# EAGLE design Mentor (EAGLE 8.2.1)
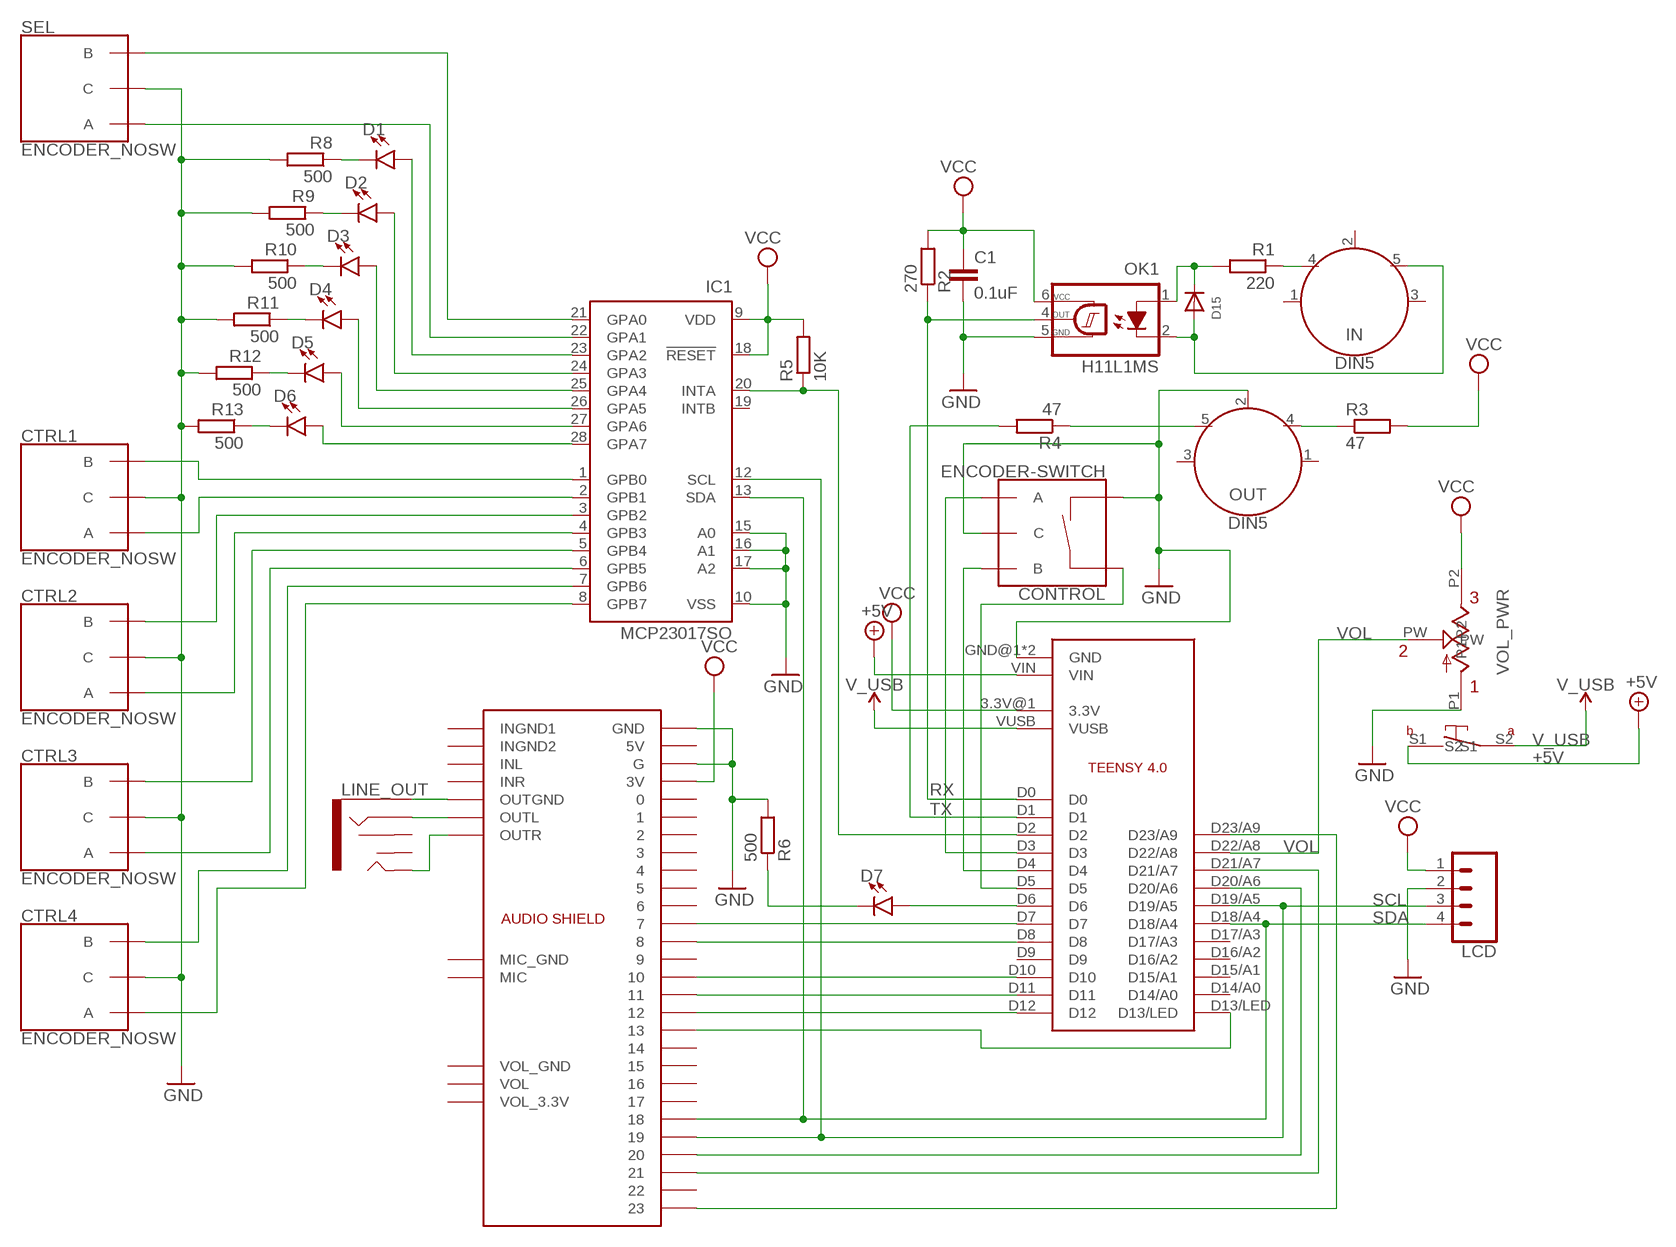
[diagram p0: schematic, sheet 1]

## Parts
C1  0.1uF  C-EUC0603K  [C0603K]
CONTROL  ENCODER-SWITCH  [ROTARY_ENC_PLAIN]
CTRL1  ENCODER_NOSW  [ENCODER_NOSW]
CTRL2  ENCODER_NOSW  [ENCODER_NOSW]
CTRL3  ENCODER_NOSW  [ENCODER_NOSW]
CTRL4  ENCODER_NOSW  [ENCODER_NOSW]
D1  LED3MM  [LED_3MM]
D2  LED3MM  [LED_3MM]
D3  LED3MM  [LED_3MM]
D4  LED3MM  [LED_3MM]
D5  LED3MM  [LED_3MM]
D6  LED3MM  [LED_3MM]
D7  LED3MM  [LED_3MM]
D15  DIODESOD-123  [SOD-123]
IC1  MCP23017SO  [SO28W]
IN  DIN5  [DIN5-RA-PTH]
LCD  CONN_04LONGPADS  [1X04_LONGPADS]
LINE_OUT  AUDIO_JACK_3.5MM_PTH  [AUDIO-JACK]
OK1  H11L1MS  [DIL6-SMD]
OUT  DIN5  [DIN5-RA-PTH]
R1  220  R-EU_R0603  [R0603]
R2  270  R-EU_R0603  [R0603]
R3  47  R-EU_R0603  [R0603]
R4  47  R-EU_R0603  [R0603]
R5  10K  R-EU_R0603  [R0603]
R6  500  R-EU_R0603  [R0603]
R8  500  R-EU_R0603  [R0603]
R9  500  R-EU_R0603  [R0603]
R10  500  R-EU_R0603  [R0603]
R11  500  R-EU_R0603  [R0603]
R12  500  R-EU_R0603  [R0603]
R13  500  R-EU_R0603  [R0603]
SEL  ENCODER_NOSW  [ENCODER_NOSW]
U$2  TEENSY4.0_SIMPLE  [TEENSY4.0_SIMPLE]
U$3  AUDIO SHIELD  AUDIOSHIELD  [AUDIOSHIELD]
VOL_PWR  10K  RK097-SINGLE-W/SWITCH-ROTARY  [RK097-SINGLE-W/SWITCH]

## Nets
+5V: U$2.VIN VOL_PWR.S1
GND: C1.2 CONTROL.C CONTROL.SW- CTRL1.C CTRL2.C CTRL3.C CTRL4.C IC1.10(VSS) IC1.15(A0) IC1.16(A1) IC1.17(A2) LCD.2 OK1.5(GND) OUT.2 R6.2 R8.2 R9.2 R10.2 R11.2 R12.2 R13.2 SEL.C U$2.GND@1(GND) U$2.GND@2(GND) U$3.G U$3.GND VOL_PWR.P1
MISO: U$2.D12 U$3.12
MOSI: U$2.D11 U$3.11
N$1: IC1.21(GPA0) SEL.B
N$2: IC1.22(GPA1) SEL.A
N$3: CTRL1.B IC1.1(GPB0)
N$4: CTRL1.A IC1.2(GPB1)
N$5: CTRL2.B IC1.3(GPB2)
N$6: CTRL2.A IC1.4(GPB3)
N$7: CTRL3.B IC1.5(GPB4)
N$8: CTRL3.A IC1.6(GPB5)
N$9: CTRL4.B IC1.7(GPB6)
N$10: CTRL4.A IC1.8(GPB7)
N$11: OUT.5 R4.1
N$12: U$2.D20/A6 U$3.20
N$13: U$2.D21/A7 U$3.21
N$14: U$2.D23/A9 U$3.23
N$15: U$2.D10 U$3.10
N$16: U$2.D7 U$3.7
N$17: U$2.D8 U$3.8
N$18: IC1.20(INTA) R5.1 U$2.D2
N$19: D6.K(C) R13.1
N$20: D1.K(C) R8.1
N$21: D6.A IC1.28(GPA7)
N$22: D7.K(C) R6.1
N$23: D7.A U$2.D6
N$24: D2.K(C) R9.1
N$25: D3.K(C) R10.1
N$26: D3.A IC1.25(GPA4)
N$27: CONTROL.A U$2.D3
N$28: CONTROL.B U$2.D4
N$29: CONTROL.SW+ U$2.D5
N$30: D4.K(C) R11.1
N$32: D5.K(C) R12.1
N$36: D15.A IN.5 OK1.2(C)
N$37: D15.C OK1.1(A) R1.2
N$38: IN.4 R1.1
N$39: LINE_OUT.SLEEVE U$3.OUTGND
N$43: OUT.4 R3.1
N$44: LINE_OUT.RING U$3.OUTL
N$45: LINE_OUT.TIP U$3.OUTR
RX: OK1.4(OUT) R2.1 U$2.D0
SCK: U$2.D13/LED U$3.13
SCL: IC1.12(SCL) LCD.3 U$2.D19/A5 U$3.19
SDA: IC1.13(SDA) LCD.4 U$2.D18/A4 U$3.18
SEL1: D1.A IC1.23(GPA2)
SEL2: D2.A IC1.24(GPA3)
SEL4: D4.A IC1.26(GPA5)
SEL5: D5.A IC1.27(GPA6)
TX: R4.2 U$2.D1
V_USB: U$2.VUSB VOL_PWR.S2
VCC: C1.1 IC1.9(VDD) IC1.18(!RESET) LCD.1 OK1.6(VCC) R2.2 R3.2 R5.2 U$2.3.3V@1(3.3V) U$3.3V VOL_PWR.P2
VOL: U$2.D22/A8 VOL_PWR.PW
Unconnected: IC1.19(INTB) IN.1 IN.2 IN.3 LINE_OUT.RSH LINE_OUT.TSH OUT.1 OUT.3 U$2.D9 U$2.D14/A0 U$2.D15/A1 U$2.D16/A2 U$2.D17/A3 U$3.0 U$3.1 U$3.2 U$3.3 U$3.4 U$3.5 U$3.5V U$3.6 U$3.9 U$3.14 U$3.15 U$3.16 U$3.17 U$3.22 U$3.GND_MIC(MIC_GND) U$3.INGND1 U$3.INGND2 U$3.INL U$3.INR U$3.MIC U$3.VOL U$3.VOL_3.3V U$3.VOL_GND

## Notes on the sheet
- AUDIO SHIELD

## Library data of the parts
C1 = rcl:C-EU: CAPACITOR, European symbol
CONTROL = SparkFun-Switches:ENCODER-SWITCH: Rotary Encoder w/ Select Switch Encoders rotate similarly to potentiometers, but they’re different from potentiometers in that an encoder has full rotation without limits. They output gray code so that you can tell how much and in which direction the encoder has been turned. This encoder includes a push-down select switch built into the shaft. SparkFun Products Rotary Encoder <https://www.sparkfun.com/products/9117> (COM-09117); SF_SKU: COM-09117
CTRL1-CTRL4 SEL = SparkFun-Switches:ENCODER_NOSW
D1-D7 = SparkFun-LED:LED: LED (Generic) Standard schematic elements and footprints for 5mm, 3mm, 1206, and 0603 sized LEDs. Generic LEDs with no color specified.; PROD_ID: DIO-08794
D15 = adafruit:DIODE: Diode SMADIODE - SMA Surface Mount Package 20V 1A Schottky Diode Digikey: 641-1014-6-ND DO-1N4148 - Through Hole Small Current Diode SOD-123 20V 1 A (.5mV Vf) Schottky Diode - Digikey: MBRX120TPMSCT-ND SOD-323 10V 570mA (.38mV Vf, 3ns) Schottky Diode - Digikey: ZLLS410CT-ND SOD-523 30V 30mA Schottky Diode (RB751S-40TE61) - Digikey: RB751S-40TE61CT-ND SOT23-R/W - SOT23 Package (R = Solder Paste/Reflow Ovens, W = Hand-Soldering) BAT54Film 40V 300mA - Digikey: 497-7162-1-ND
IC1 = adafruit:MCP23017: http://ww1.microchip.com/downloads/en/DeviceDoc/21952a.pdf Source: http://ww1.microchip.com/downloads/en/DeviceDoc/21952a.pdf
IN OUT = SparkFun-Connectors:DIN5: DIN5 Connector - Female Right Angle (frequently used as a MIDI Jack connector) This type of connector and cable is frequently used for transmitting midi data (musical instrument digital interface). It is what you usually see on a keyboard or set of electronic drums. Learn more here <https://en.wikipedia.org/wiki/MIDI>. For more information on the pinout and electrical specifications of MIDI communications, please see the following resource: https://www.midi.org/specifications/item/midi-din-electrical-specification Here is the connector we sell at SparkFun: MIDI Connector - Female Right Angle <https://www.sparkfun.com/products/9536> (PRT-09536) Datasheet <hhttp://www.sparkfun.com/datasheets/Prototyping/Connectors/MIDI-RA.pdf> It is used on this SparkFun product: SparkFun MIDI Shield <https://www.sparkfun.com/products/12898> (DEV-12898); PROD_ID: CONN-09481
LCD = SparkFun-Connectors:CONN_04: Multi connection point. Often used as Generic Header-pin footprint for 0.1 inch spaced/style header connections On any of the 0.1 inch spaced packages, you can populate with these: Break Away Headers - Straight <https://www.sparkfun.com/products/116> (PRT-00116) Break Away Male Headers - Right Angle <https://www.sparkfun.com/products/553> (PRT-00553) Female Headers <https://www.sparkfun.com/products/115> (PRT-00115) Break Away Headers - Machine Pin <https://www.sparkfun.com/products/117> (PRT-00117) Break Away Female Headers - Swiss Machine Pin <https://www.sparkfun.com/products/743> (PRT-00743) For SCREWTERMINALS and SPRING TERMINALS visit here: Screw Terimnals on SparkFun.com <https://www.sparkfun.com/search/results?term=Screw+Terminals> (5mm/3.5mm/2.54mm spacing) This device is also useful as a general connection point to wire up your design to another part of your project. Our various solder wires solder well into these plated through hole pads. Hook-Up Wire - Assortment (Stranded, 22 AWG) <https://www.sparkfun.com/products/11375> (PRT-11375) Hook-Up Wire - Assortment (Solid Core, 22 AWG) <https://www.sparkfun.com/products/11367> (PRT-11367) View the entire wire category on our website here <https://www.sparkfun.com/categories/141> Special notes: Molex polarized connector foot print use with SKU : PRT-08231 with associated crimp pins and housings. 1MM SMD Version SKU: PRT-10208; PROD_ID: CONN-09696
LINE_OUT = SparkFun-Connectors:AUDIO_JACK_3.5MM: Audio Jack 3.5mm variants of PTH and SMT stereo audio jack with bypass switches. SparkFun Products: SparkFun SparkPunk Sound Kit <[https://www.sparkfun.com/products/11177]> - PTH MP3 Trigger <https://www.sparkfun.com/products/13720> -3.5mm SMD SparkFun PicoBoard <https://www.sparkfun.com/products/11888>- 2.5mm SMD; PROD_ID: CONN-08774; SF_ID: PRT-08032
OK1 = optocoupler:H11L*M: 6-Pin DIP Optocoupler Source: http://www.fairchildsemi.com/ds/H1/H11L2-M.pdf; OC_FARNELL: unknown; OC_NEWARK: unknown
R1-R6 R8-R13 = resistor:R-EU_: RESISTOR, European symbol
U$2 = Teensy4.0_SIMPLE:TEENSY4.0_SIMPLE
U$3 = Teensy_Audioshield_alt:AUDIOSHIELD: Teensy 3 Audioshield by PJRC.COM
VOL_PWR = alps_japan_potentiometers:RK097-SINGLE-W/SWITCH-ROTARY: Shematic Single Element w/ Switch

## Board
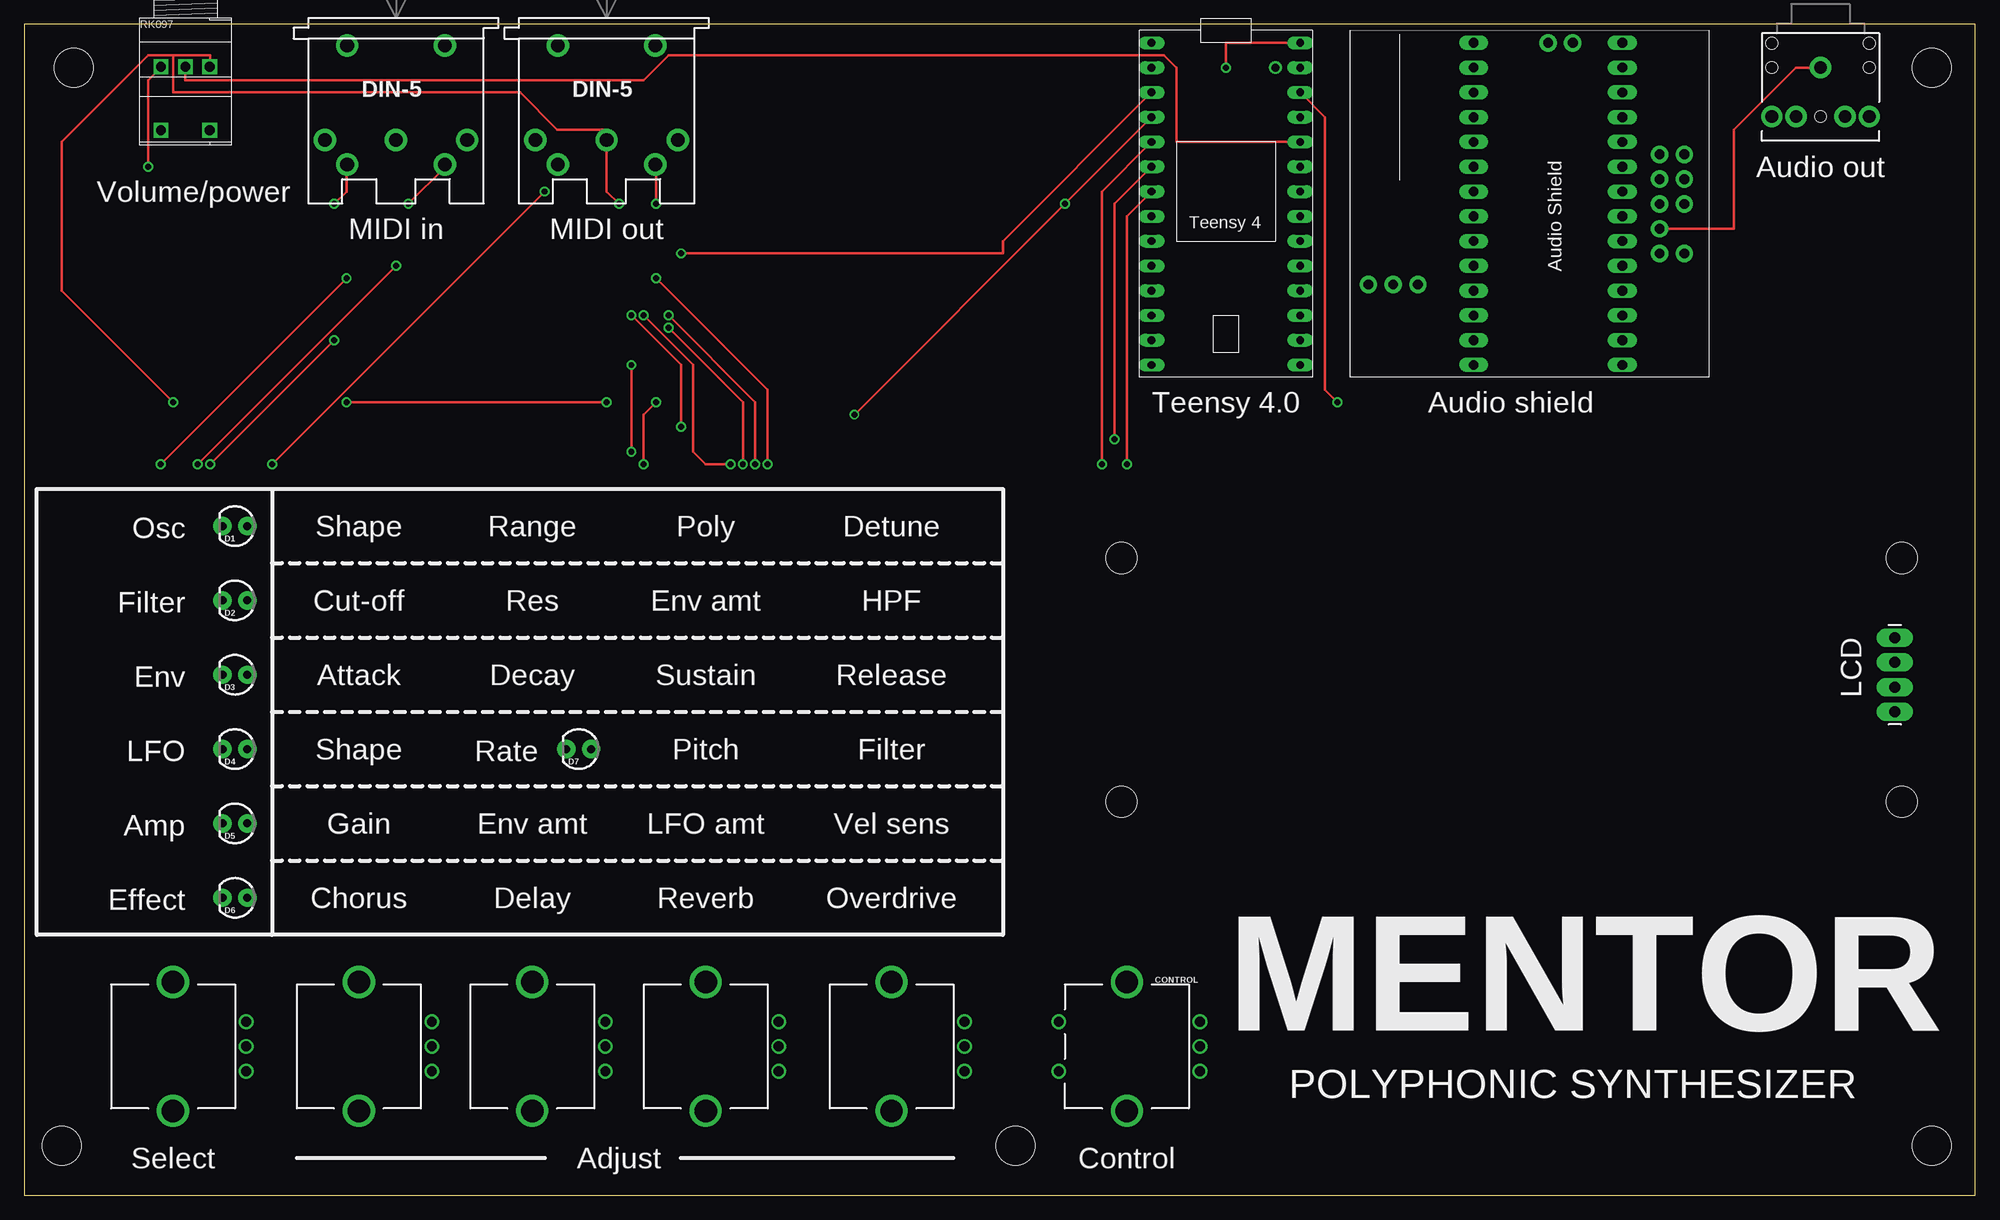
[diagram p1: board, top side]
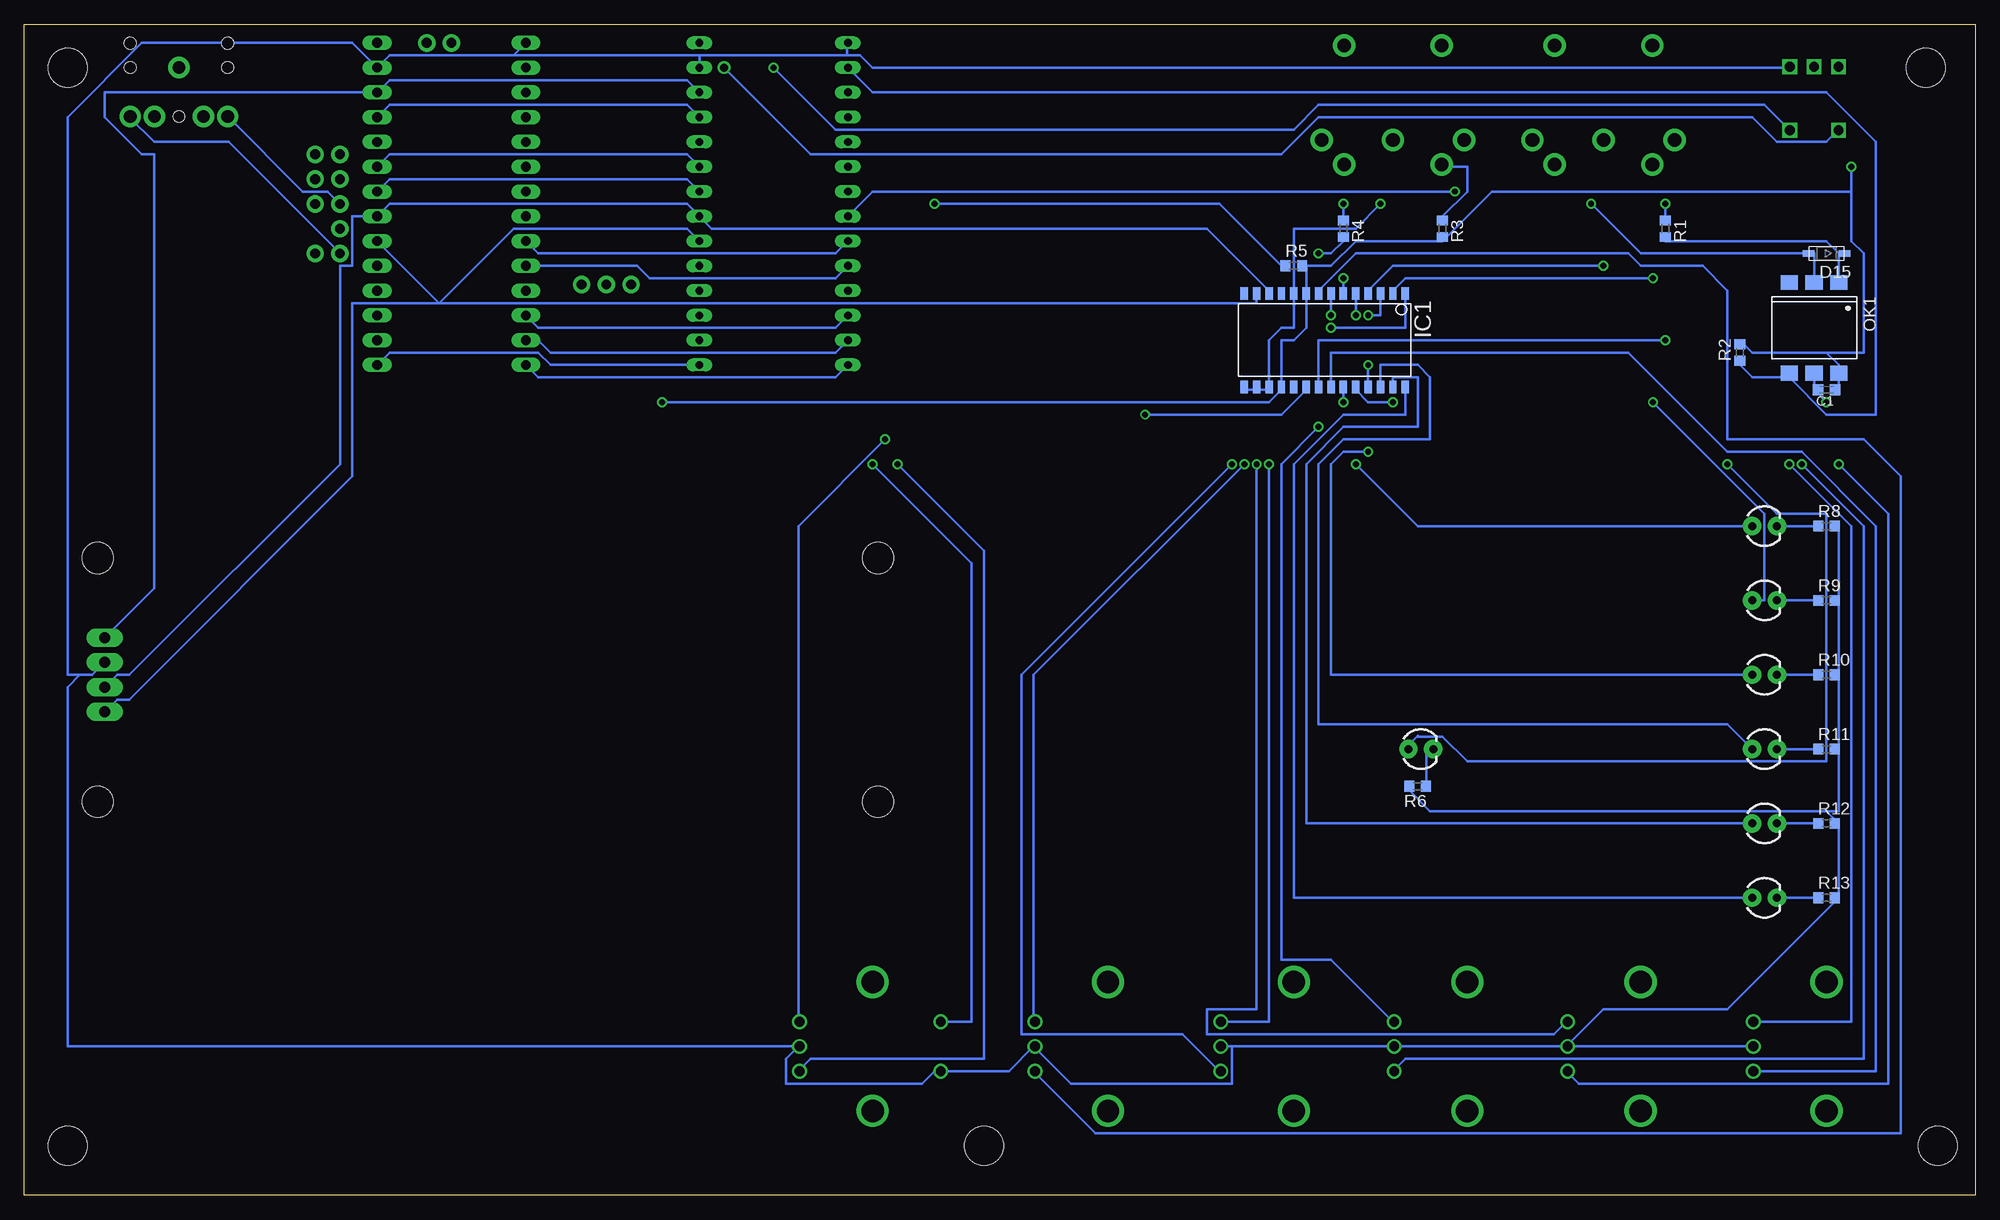
[diagram p2: board, bottom side, seen from below]

Size 200 x 120 mm. Coordinates in mm from the lower left corner, seen from the top.
Outline: 0,0 200,0 200,120 0,120 0,0
Copper layers (1*16): Top 0.035mm / dielectric 1.5mm / Bottom 0.035mm
Design rules "default": minimum track width 10mil, minimum drill 24mil, track to track 8mil, track to pad 8mil, pad to pad 8mil, via to via 8mil, smd to smd 8mil, copper to edge 40mil, drill to drill 8mil, minimum pad ring 10mil, minimum via ring 8mil, stop-mask expansion 4mil, vias tented up to drill 0mil, thermal gap 10mil
Holes 3.2 mm at 112.49,65.31 112.49,40.31 192.49,65.31 192.49,40.31
Holes 4 mm at 5.08,115.57 195.58,115.57 195.58,5.08 3.81,5.08 101.6,5.08
tKeepout: 4 lines
tRestrict: area 1.3,1.3 to 198.1,73.7; area 4.5,101 to 28.3,104.5; area 31.4,97 to 44.8,100.8; area 51.8,97 to 66.8,101; area 113.3,79.4 to 132.9,83; area 140.7,79.4 to 163.8,83.2; area 175.4,103.5 to 192.7,106.8

### Footprints (pad centres in the part's own frame; a part is rotated, then mirrored left to right if it is on the bottom)
C0603K = smd 1.05 x 1.08: 1 -0.875,0; 2 0.875,0
ROTARY_ENC_PLAIN = drill 1.016: A 7.493,-2.54; B 7.493,2.54; C 7.493,0; SW+ -6.985,2.54; SW- -6.985,-2.54 | drill 2.286: P$3 0,6.604; P$4 0,-6.604
ENCODER_NOSW = drill 1.016: A 7.493,-2.54; B 7.493,2.54; C 7.493,0 | drill 2.286: P$3 0,6.604; P$4 0,-6.604
LED_3MM = drill 0.813 pad 1.88: A -1.27,0; K 1.27,0
SOD-123 = smd 1.2 x 0.7: A 1.85,0; C -1.85,0
SO28W = smd 0.762 x 1.27: 1 -7.62,-4.78; 2 -6.35,-4.78; 3 -5.08,-4.78; 4 -3.81,-4.78; 5 -2.54,-4.78; 6 -1.27,-4.78; 7 0,-4.78; 8 1.27,-4.78; 9 2.54,-4.78; 10 3.81,-4.78; 11 5.08,-4.78; 12 6.35,-4.78; 13 7.62,-4.78; 14 8.89,-4.78; 15 8.89,4.78; 16 7.62,4.78; 17 6.35,4.78; 18 5.08,4.78; 19 3.81,4.78; 20 2.54,4.78; 21 1.27,4.78; 22 0,4.78; 23 -1.27,4.78; 24 -2.54,4.78; 25 -3.81,4.78; 26 -5.08,4.78; 27 -6.35,4.78; 28 -7.62,4.78
DIN5-RA-PTH = drill 1.4 pad 2.286: 1 7.3,12.5; 2 0,12.5; 3 -7.3,12.5; 4 5,15; 5 -5,15; 6 -5,2.8; 7 5,2.8
1X04_LONGPADS = drill 1.118 pad 1.88 long: 1 0,0; 2 2.54,0; 3 5.08,0; 4 7.62,0
AUDIO-JACK = drill 1.3 pad 2.184: RING 5,5; RSH 5,2.5; SLEEVE 0,0; TIP 5,-5; TSH 5,-2.5 | hole 1.2: 0,5; -2.5,5; -2.5,-5; 0,-5; 5,0
DIL6-SMD = smd 1.78 x 1.52: 1 -2.54,-4.645; 2 0,-4.645; 3 2.54,-4.645; 4 2.54,4.645; 5 0,4.645; 6 -2.54,4.645
R0603 = smd 1 x 1.1: 1 -0.85,0; 2 0.85,0
TEENSY4.0_SIMPLE = drill 0.8 long: 3.3V@1 7.62,10.16; D0 -7.62,12.7; D1 -7.62,10.16; D2 -7.62,7.62; D3 -7.62,5.08; D4 -7.62,2.54; D5 -7.62,0; D6 -7.62,-2.54; D7 -7.62,-5.08; D8 -7.62,-7.62; D9 -7.62,-10.16; D10 -7.62,-12.7; D11 -7.62,-15.24; D12 -7.62,-17.78; D13/LED 7.62,-17.78; D14/A0 7.62,-15.24; D15/A1 7.62,-12.7; D16/A2 7.62,-10.16; D17/A3 7.62,-7.62; D18/A4 7.62,-5.08; D19/A5 7.62,-2.54; D20/A6 7.62,0; D21/A7 7.62,2.54; D22/A8 7.62,5.08; D23/A9 7.62,7.62; GND@1 -7.62,15.24; GND@2 7.62,12.7; VIN 7.62,15.24 | drill 0.8: VUSB 5.08,12.7
AUDIOSHIELD = drill 1 long: 0 -13.97,-5.08; 1 -11.43,-5.08; 2 -8.89,-5.08; 3 -6.35,-5.08; 3V -11.43,10.16; 4 -3.81,-5.08; 5 -1.27,-5.08; 5V -16.51,10.16; 6 1.27,-5.08; 7 3.81,-5.08; 8 6.35,-5.08; 9 8.89,-5.08; 10 11.43,-5.08; 11 13.97,-5.08; 12 16.51,-5.08; 13 16.51,10.16; 14 13.97,10.16; 15 11.43,10.16; 16 8.89,10.16; 17 6.35,10.16; 18 3.81,10.16; 19 1.27,10.16; 20 -1.27,10.16; 21 -3.81,10.16; 22 -6.35,10.16; 23 -8.89,10.16; G -13.97,10.16; GND -16.51,-5.08 | drill 1 pad 1.778: GND_MIC -16.51,2.54; INGND1 -5.08,16.51; INGND2 -2.54,16.51; INL -5.08,13.97; INR -2.54,13.97; MIC -16.51,5.08; OUTGND 2.54,13.97; OUTL 5.08,13.97; OUTR 0,13.97; UNUSED1 0,16.51; UNUSED2 5.08,16.51; VOL 8.255,-13.335; VOL_3.3V 8.255,-15.875; VOL_GND 8.255,-10.795
RK097-SINGLE-W/SWITCH = drill 1 pad 1.422 square: P1 -2.5,-0.08; P2 2.5,-0.08; PW 0,-0.08; S1 -2.5,6.42; S2 2.5,6.42

### Placement (x,y rotation side)
C1  15.24,82.55 180 bottom
CONTROL  113.03,15.24 0 top
CTRL1  34.29,15.24 0 top
CTRL2  52.07,15.24 0 top
CTRL3  69.85,15.24 0 top
CTRL4  88.9,15.24 0 top
D1  21.59,68.58 180 top
D2  21.59,60.96 180 top
D3  21.59,53.34 180 top
D4  21.59,45.72 180 top
D5  21.59,38.1 180 top
D6  21.59,30.48 180 top
D7  56.83,45.72 180 top
D15  15.24,96.52 180 bottom
IC1  66.04,87.63 180 bottom
IN  38.1,120.65 180 top
LCD  191.77,57.15 270 top
LINE_OUT  184.15,115.57 270 top
OK1  16.51,88.9 180 bottom
OUT  59.69,120.65 180 top
R1  31.75,99.06 270 bottom
R2  24.13,86.36 90 bottom
R3  54.61,99.06 270 bottom
R4  64.77,99.06 270 bottom
R5  69.85,95.25 0 bottom
R6  57.15,41.91 180 bottom
R8  15.24,68.58 0 bottom
R9  15.24,60.96 0 bottom
R10  15.24,53.34 0 bottom
R11  15.24,45.72 0 bottom
R12  15.24,38.1 0 bottom
R13  15.24,30.48 0 bottom
SEL  15.24,15.24 0 top
U$2  123.19,102.87 0 top
U$3  153.67,101.6 270 top
VOL_PWR  16.51,115.57 180 top

### Tracks (layer width: path | path; a pad name or v marks a point on that pad's centre or on a via)
+5V  (via drill 0.61)
  Top 0.254: U$2.VIN 123.19,118.11 v123.19,115.57
  Bottom 0.254: v123.19,115.57 116.84,109.22 69.85,109.22 67.31,111.76 21.59,111.76 19.05,109.22 VOL_PWR.S1
GND  (via drill 0.61)
  Top 0.254: v15.24,81.28 3.81,92.71 3.81,107.95 12.7,116.84 15.24,116.84 | 15.24,116.84 19.05,116.84 19.05,115.57 VOL_PWR.P1 | 15.24,116.84 15.24,113.03 50.8,113.03 54.61,109.22 59.69,109.22 OUT.2 59.69,102.87 v60.96,101.6
  Bottom 0.254: 41.91,15.24 CTRL2.C 76.2,15.24 | 76.2,15.24 CTRL3.C 77.47,15.24 | 73.66,82.55 72.39,82.55 IC1.17 72.39,87.63 71.12,88.9 69.85,88.9 IC1.10 69.85,99.06 63.5,99.06 v60.96,101.6 | 73.66,82.55 74.93,82.55 IC1.15 | 73.66,82.55 IC1.16 | OK1.5 16.51,82.55 | v15.24,81.28 16.51,82.55 | 16.51,82.55 C1.2 | 149.86,116.84 162.56,116.84 U$3.G 166.37,118.11 187.96,118.11 195.58,110.49 195.58,53.34 194.31,53.34 | U$3.GND 149.86,116.84 | 96.52,15.24 99.06,12.7 CONTROL.SW- 106.68,12.7 107.95,11.43 121.92,11.43 121.92,13.97 120.65,15.24 | LCD.2 193.04,53.34 194.31,53.34 | 194.31,53.34 195.58,52.07 195.58,15.24 120.65,15.24 | 120.65,15.24 CONTROL.C | 149.86,116.84 130.76,116.84 | 130.76,116.84 115.67,116.84 | 115.67,116.84 114.3,116.84 113.03,115.57 19.05,115.57 VOL_PWR.P1 | 76.2,15.24 76.2,11.43 92.71,11.43 96.52,15.24 | 96.52,15.24 CTRL4.C | SEL.C CTRL1.C 41.91,15.24 | 13.97,60.96 13.97,68.58 R8.2 | 13.97,53.34 13.97,45.72 | 13.97,38.1 13.97,30.48 | 15.24,39.37 55.88,39.37 58.42,41.91 R6.2 | 13.97,38.1 15.24,39.37 | 13.97,38.1 R12.2 | 13.97,45.72 13.97,39.37 15.24,39.37 | 13.97,45.72 R11.2 | 13.97,53.34 13.97,60.96 | 13.97,60.96 R9.2 | 13.97,53.34 R10.2 | 41.91,15.24 38.1,19.05 25.4,19.05 13.97,30.48 | 13.97,30.48 R13.2 | 130.76,116.84 130.76,115.67 U$2.GND@2 | 115.67,116.84 115.67,117.96 U$2.GND@1 | 115.67,116.81 115.67,116.84
MISO
  Bottom 0.254: U$2.D12 116.84,83.82 147.32,83.82 U$3.12
MOSI
  Bottom 0.254: U$2.D11 116.84,86.36 146.05,86.36 147.32,87.63 U$3.11
N$1  (via drill 0.61)
  Top 0.254: v19.05,74.93 v31.75,87.63
  Bottom 0.254: v31.75,87.63 67.31,87.63 IC1.21 67.31,82.55 | v19.05,74.93 12.7,68.58 12.7,17.78 SEL.B 22.86,17.78
N$2
  Bottom 0.254: 66.04,82.55 IC1.22 66.04,86.36 35.56,86.36 25.4,76.2 17.78,76.2 10.16,68.58 10.16,12.7 SEL.A 22.86,12.7
N$3  (via drill 0.61)
  Top 0.254: v66.04,88.9 73.66,81.28 v73.66,74.93
  Bottom 0.254: v66.04,88.9 58.42,88.9 IC1.1 58.42,92.71 | v73.66,74.93 73.66,19.05 78.74,19.05 78.74,16.51 43.18,16.51 41.91,17.78 CTRL1.B
N$4  (via drill 0.61)
  Top 0.254: v13.97,74.93 v33.02,93.98
  Bottom 0.254: v33.02,93.98 58.42,93.98 59.69,92.71 IC1.2 | v13.97,74.93 8.89,69.85 8.89,11.43 40.64,11.43 41.91,12.7 CTRL1.A
N$5  (via drill 0.61)
  Top 0.254: v62.23,90.17 67.31,85.09 v67.31,78.74
  Bottom 0.254: v62.23,90.17 60.96,90.17 IC1.3 60.96,92.71 | v67.31,78.74 71.12,74.93 71.12,24.13 66.04,24.13 59.69,17.78 CTRL2.B
N$6  (via drill 0.61)
  Top 0.254: v17.78,74.93 v38.1,95.25
  Bottom 0.254: v38.1,95.25 59.69,95.25 62.23,92.71 IC1.4 | v17.78,74.93 11.43,68.58 11.43,13.97 58.42,13.97 59.69,12.7 CTRL2.A
N$7  (via drill 0.61)
  Top 0.254: v63.5,90.17 68.58,85.09 68.58,76.2 69.85,74.93 v72.39,74.93
  Bottom 0.254: v63.5,90.17 IC1.5 63.5,92.71 | v72.39,74.93 72.39,17.78 CTRL3.B 77.47,17.78
N$8  (via drill 0.61)
  Top 0.254: v64.77,93.98 76.2,82.55 v76.2,74.93
  Bottom 0.254: v64.77,93.98 IC1.6 | v76.2,74.93 97.79,53.34 97.79,16.51 81.28,16.51 77.47,12.7 CTRL3.A
N$9  (via drill 0.61)
  Top 0.254: v66.04,90.17 74.93,81.28 v74.93,74.93
  Bottom 0.254: v66.04,90.17 IC1.7 66.04,92.71 | v74.93,74.93 96.52,53.34 96.52,17.78 CTRL4.B
N$10
  Bottom 0.254: IC1.8 67.31,92.71 63.5,96.52 35.56,96.52 34.29,95.25 27.94,95.25 25.4,92.71 25.4,77.47 11.43,77.47 7.62,73.66 7.62,6.35 90.17,6.35 96.52,12.7 CTRL4.A
N$11  (via drill 0.61)
  Top 0.254: v64.77,101.6 64.77,105.41 OUT.5
  Bottom 0.254: v64.77,101.6 R4.1
N$12
  Bottom 0.254: U$2.D20/A6 132.08,104.14 162.56,104.14 U$3.20
N$13
  Bottom 0.254: U$2.D21/A7 132.08,106.68 162.56,106.68 U$3.21
N$14
  Bottom 0.254: U$2.D23/A9 132.08,111.76 162.56,111.76 U$3.23
N$15
  Bottom 0.254: U$2.D10 116.84,88.9 147.32,88.9 U$3.10
N$16
  Bottom 0.254: U$2.D7 116.84,96.52 147.32,96.52 U$3.7
N$17
  Bottom 0.254: U$2.D8 116.84,93.98 135.89,93.98 137.16,95.25 U$3.8
N$18  (via drill 0.61)
  Top 0.254: U$2.D2 v106.68,101.6 v85.09,80.01
  Bottom 0.254: v106.68,101.6 77.47,101.6 71.12,95.25 R5.1 | v85.09,80.01 71.12,80.01 68.58,82.55 IC1.20
N$19
  Bottom 0.254: D6.K R13.1
N$20
  Bottom 0.254: D1.K R8.1
N$21
  Bottom 0.254: IC1.28 58.42,80.01 64.77,80.01 69.85,74.93 69.85,30.48 D6.A
N$22
  Bottom 0.254: R6.1 56.24,42.06 56.24,45.26 55.78,45.72 D7.K
N$23  (via drill 0.61)
  Top 0.254: v25.4,74.93 v53.34,102.87
  Bottom 0.254: U$2.D6 113.03,102.87 v53.34,102.87 | v25.4,74.93 20.32,69.85 15.24,69.85 15.24,44.45 52.07,44.45 54.61,46.99 57.15,46.99 57.15,47.09 58.06,46.18 58.06,45.72 D7.A
N$24
  Bottom 0.254: D2.K R9.1
N$25
  Bottom 0.254: D3.K R10.1
N$26  (via drill 0.61)
  Top 0.254: v62.23,76.2 v62.23,85.09
  Bottom 0.254: v62.23,85.09 IC1.25 62.23,82.55 | v62.23,76.2 64.77,76.2 66.04,74.93 66.04,53.34 D3.A
N$27  (via drill 0.61)
  Top 0.254: U$2.D3 110.49,102.87 v110.49,74.93
  Bottom 0.254: v110.49,74.93 101.6,66.04 101.6,13.97 119.38,13.97 120.65,12.7 CONTROL.A
N$28  (via drill 0.61)
  Top 0.254: U$2.D4 111.76,101.6 v111.76,77.47
  Bottom 0.254: v111.76,77.47 120.65,68.58 120.65,17.78 CONTROL.B
N$29  (via drill 0.61)
  Top 0.254: U$2.D5 113.03,100.33 v113.03,74.93
  Bottom 0.254: v113.03,74.93 102.87,64.77 102.87,17.78 CONTROL.SW+
N$30
  Bottom 0.254: D4.K R11.1
N$32
  Bottom 0.254: D5.K R12.1
N$36  (via drill 0.61)
  Top 0.254: v39.37,101.6 43.18,105.41 IN.5
  Bottom 0.254: OK1.2 16.51,96.52 D15.A 34.29,96.52 v39.37,101.6
N$37
  Bottom 0.254: 13.97,96.52 15.24,97.79 31.75,97.79 R1.2 | 13.97,96.52 OK1.1 | 13.97,96.52 D15.C
N$38  (via drill 0.61)
  Top 0.254: v31.75,101.6 33.02,102.87 33.02,105.41 IN.4
  Bottom 0.254: v31.75,101.6 R1.1
N$39
  Top 0.254: U$3.OUTGND 175.26,99.06 175.26,109.22 181.61,115.57 LINE_OUT.SLEEVE
N$43
  Bottom 0.254: R3.1 54.61,100.33 52.07,102.87 52.07,105.41 54.61,105.41 OUT.4
N$44
  Bottom 0.254: U$3.OUTL 179.07,107.95 186.69,107.95 189.23,110.49 LINE_OUT.RING
N$45
  Bottom 0.254: U$3.OUTR 168.91,102.87 171.45,102.87 LINE_OUT.TIP
RX
  Bottom 0.254: 19.05,83.82 22.86,83.82 24.13,85.09 R2.1 | U$2.D0 113.03,113.03 15.24,113.03 10.16,107.95 10.16,80.01 15.24,80.01 19.05,83.82 | 19.05,83.82 OK1.4
SCK
  Bottom 0.254: U$2.D13/LED 146.05,85.09 147.32,86.36 162.56,86.36 U$3.13
SCL
  Bottom 0.254: IC1.12 72.39,92.71 78.74,99.06 129.54,99.06 U$2.D19/A5 132.08,101.6 162.56,101.6 U$3.19 166.37,100.33 166.37,95.25 167.64,95.25 167.64,74.93 189.23,53.34 190.5,53.34 LCD.3
SDA
  Bottom 0.254: 157.48,91.44 73.66,91.44 IC1.13 73.66,92.71 | U$3.18 157.48,91.44 | U$2.D18/A4 132.08,99.06 149.86,99.06 157.48,91.44 | LCD.4 190.5,50.8 189.23,50.8 166.37,73.66 166.37,91.44 157.48,91.44
SEL1  (via drill 0.61)
  Top 0.254: v64.77,81.28 63.5,80.01 v63.5,74.93
  Bottom 0.254: v64.77,81.28 IC1.23 | v63.5,74.93 57.15,68.58 D1.A
SEL2  (via drill 0.61)
  Top 0.254: v33.02,81.28 v59.69,81.28
  Bottom 0.254: v59.69,81.28 62.23,81.28 63.5,82.55 IC1.24 | v33.02,81.28 21.59,69.85 21.59,60.96 D2.A
SEL4
  Bottom 0.254: D4.A 25.4,48.26 67.31,48.26 67.31,74.93 64.77,77.47 55.88,77.47 55.88,83.82 57.15,85.09 60.96,85.09 IC1.26 60.96,82.55
SEL5
  Bottom 0.254: D5.A 68.58,38.1 68.58,74.93 64.77,78.74 57.15,78.74 57.15,83.82 59.69,83.82 IC1.27 59.69,82.55
TX  (via drill 0.61)
  Top 0.254: v67.31,96.52 100.33,96.52 100.33,97.79 U$2.D1
  Bottom 0.254: v67.31,96.52 66.04,96.52 64.77,97.79 R4.2
V_USB
  Bottom 0.254: U$2.VUSB 119.38,106.68 71.12,106.68 67.31,110.49 22.86,110.49 20.32,107.95 15.24,107.95 13.97,109.22 VOL_PWR.S2
VCC  (via drill 0.61)
  Top 0.254: v12.7,105.41 12.7,114.3 13.97,115.57 VOL_PWR.P2 | v134.62,81.28 133.35,82.55 133.35,110.49 U$2.3.3V@1
  Bottom 0.254: 68.58,95.25 IC1.9 68.58,88.9 69.85,87.63 71.12,87.63 IC1.18 71.12,82.55 72.39,81.28 v134.62,81.28 | 54.61,97.79 63.5,97.79 66.04,95.25 68.58,95.25 | 68.58,95.25 R5.2 | C1.1 13.97,82.55 OK1.6 13.97,85.09 15.24,86.36 | 15.24,86.36 22.86,86.36 24.13,87.63 R2.2 | 12.7,102.87 12.7,97.79 11.43,96.52 11.43,86.36 15.24,86.36 | 12.7,102.87 v12.7,105.41 | 54.61,97.79 49.53,102.87 12.7,102.87 | 54.61,97.79 R3.2 | U$2.3.3V@1 132.08,114.3 162.56,114.3 U$3.3V 191.77,113.03 191.77,110.49 187.96,106.68 186.69,106.68 186.69,62.23 LCD.1
VOL
  Top 0.254: U$2.D22/A8 118.11,107.95 118.11,115.57 116.84,116.84 66.04,116.84 63.5,114.3 16.51,114.3 VOL_PWR.PW

### Text on the board
tNames: Audio out | Volume/power | MIDI in | MIDI out | Teensy 4.0 | Audio shield | Shape | Range | Poly | Detune | Osc | Cut-off | Res | Env amt | HPF | Filter | Attack | Decay | Sustain | Release | Env | Shape | Pitch | Filter | LFO | Rate | Gain | Env amt | LFO amt | Vel sens | Amp | Chorus | Delay | Reverb | Overdrive | Effect | MENTOR | POLYPHONIC SYNTHESIZER | Select | Adjust | Control